# Altium schematic sheet accelerometer.SchDoc: Thymio2
size A4; Engineer: Michael Bonani; Organization: Original design LSRO-STI-EPFL; Address1: Association Mobsya; Address2: Michael Bonani; Address3: Ch. Closel 3; Address4: CH-1020 Renens; DocumentNumber: 5; Revision: 2.3; SheetNumber: 5; SheetTotal: 9; Title2: PCB principal
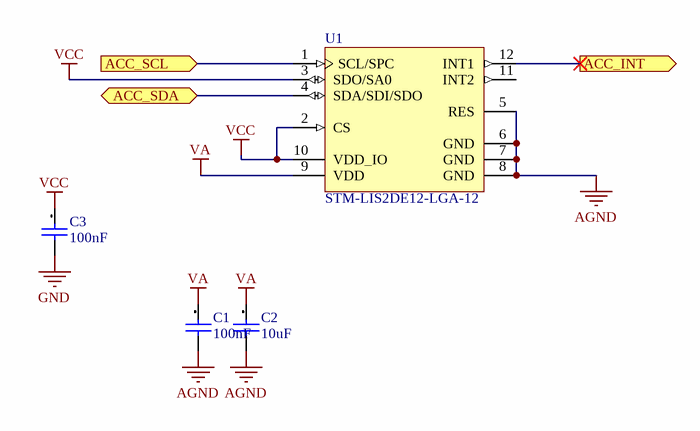
[diagram p0: accelerometer.SchDoc]

## Parts
C1  100nF  [CAPC1005X05N]
C2  10uF  [CAPC1005X05N]
C3  100nF  [CAPC1005X05N]
U1  STM-LIS2DE12-LGA-12  [STM-LGA-12]

## Ports
ACC_INT (out), ACC_SCL (in), ACC_SDA (bidir)

## Nets
AGND: C1.2 C2.2 U1.5(RES) U1.6(GND) U1.7(GND) U1.8(GND)
GND: C3.2
VA: C1.1 C2.1 U1.9(VDD)
VCC: C3.1 U1.2(CS) U1.3(SDO/SA0) U1.10(VDD_IO)
ACC_INT: U1.12(INT1) ; port ACC_INT
ACC_SCL: U1.1(SCL/SPC) ; port ACC_SCL
ACC_SDA: U1.4(SDA/SDI/SDO) ; port ACC_SDA

Not connected (* = marked no-connect by the designer): U1 11(INT2)

## Notes on the sheet
- Date:
- Project
- Part
- Revision:
- File :
- Page
- de

## Library data of the parts
C1 C3 = 100nF[[/\]]0603[[/\]]1: Capacitor; Manufacturer: Kemet; Manufacturer Nr: C0603C104K5RAC; Preference: 1; Tolerance +: +10; Tolerance -: -10; Dielectric: X7R; Voltage: 50; MaxTemperature: +125; MinTemperature: -55; Quant_1: 10; Quant_2: 100; Quant_3: 1000; Quant_4: 4000; Currentie: CHF; LayerSch: Top; Size: 0603; Footprint Acort: 0603_G; Supplier: Farnell; Supplier Nr: 1288255; ComponentLink2Description: Farnell link; ComponentLink2URL: http://ch.farnell.com/jsp/displayProduct.jsp?sku=1288255; Price_1: 0.046; Price_2: 0.04; Price_3: 0.037; Price_4: 0.036; ROHS: True; DateLastUpdate: 2007-12-03 / 14:22:31
C2 = 10uF[[/\]]0603[[/\]]1: Capacitor; Manufacturer: Taiyo Yuden; Manufacturer Nr: JMK107BJ106MA-T; Preference: 1; Tolerance +: +15; Tolerance -: -15; Dielectric: X5R; Voltage: 6.3; MaxTemperature: +85; MinTemperature: -55; Quant_2: 100; Quant_3: 500; Currentie: CHF; LayerSch: Top; Size: 0603; Footprint Acort: 0603_G; Supplier: Farnell; Supplier Nr: 1463375; ComponentLink2Description: Farnell link; ComponentLink2URL: http://ch.farnell.com/jsp/displayProduct.jsp?sku=1463375; Quant_1: 1; Price_1: 0.768; Price_2: 0.674; Price_3: 0.372; ROHS: True; DateLastUpdate: 2007-12-03 / 14:22:36
U1 = STM-LIS2HH12-LGA-12